# Altium schematic sheet Sheet1.SchDoc
size A4
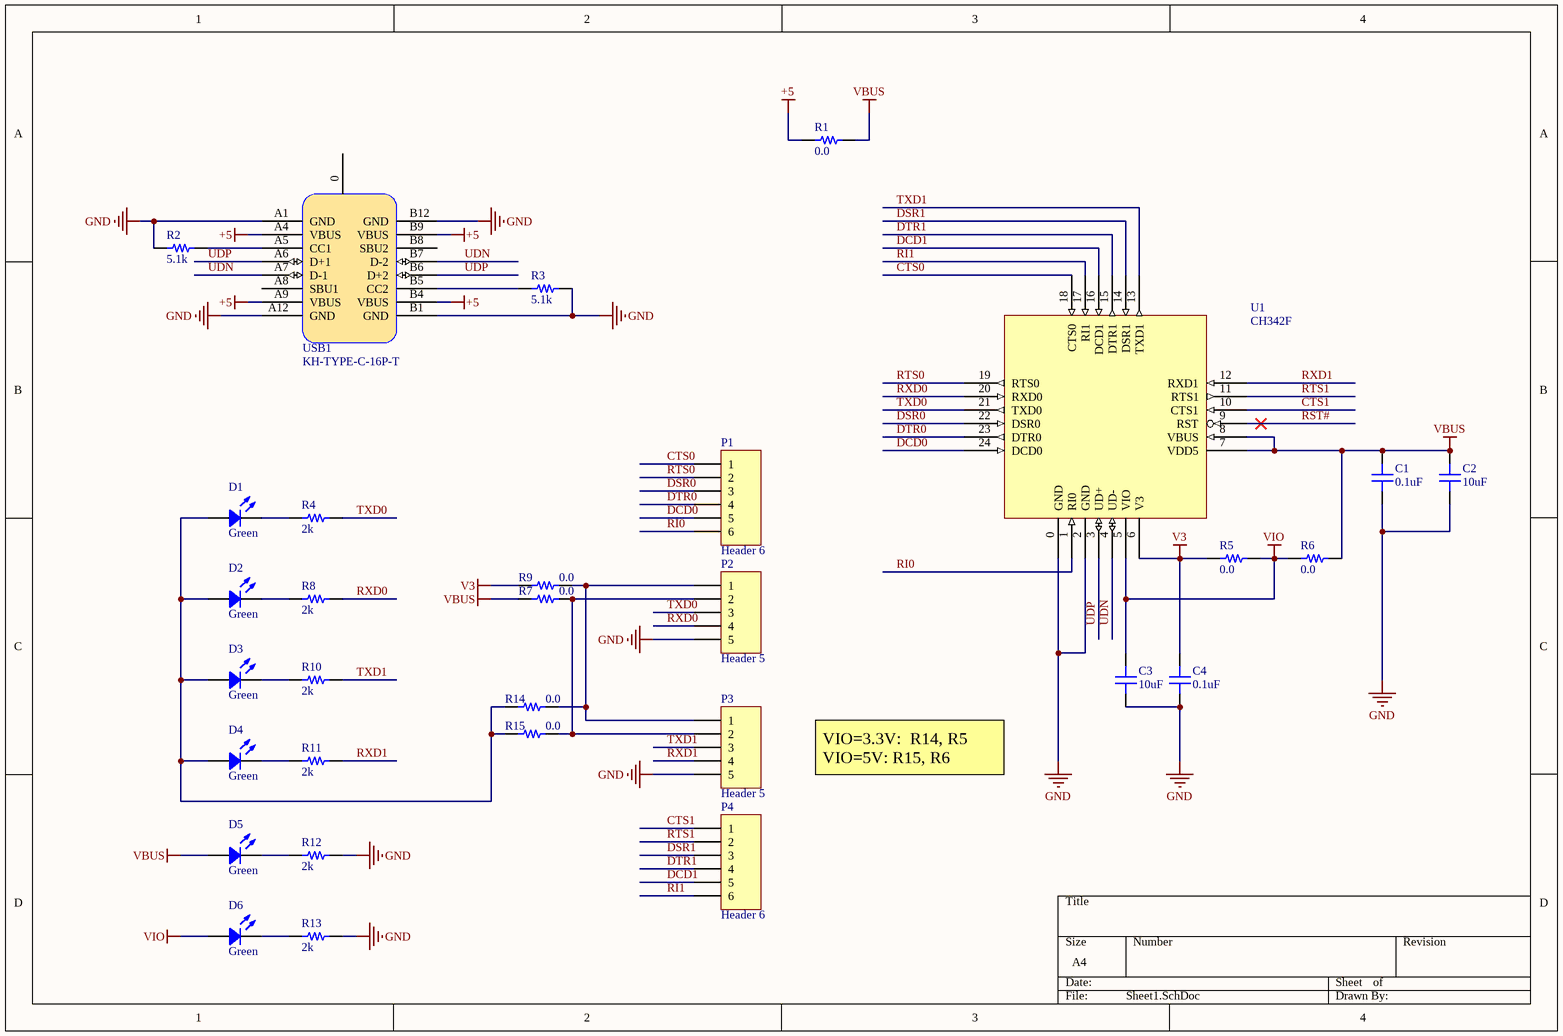
[diagram p0: Sheet1.SchDoc]

## Parts
C1  0.1uF  [CAP 0402/1005]
C2  10uF  [CAP 0805/2012]
C3  10uF  [CAP 0805/2012]
C4  0.1uF  [CAP 0402/1005]
D1  Green  [LED 0805/2012 GREEN]
D2  Green  [LED 0805/2012 GREEN]
D3  Green  [LED 0805/2012 GREEN]
D4  Green  [LED 0805/2012 GREEN]
D5  Green  [LED 0805/2012 GREEN]
D6  Green  [LED 0805/2012 GREEN]
P1  Header 6  [HDR1X6]
P2  Header 5  [HDR1X5]
P3  Header 5  [HDR1X5]
P4  Header 6  [HDR1X6]
R1  0.0  [RES 0805/2012]
R2  5.1k  [RES 0402/1005]
R3  5.1k  [RES 0402/1005]
R4  2k  [RES 0402/1005]
R5  0.0  [RES 0805/2012]
R6  0.0  [RES 0805/2012]
R7  0.0  [RES 0805/2012]
R8  2k  [RES 0402/1005]
R9  0.0  [RES 0805/2012]
R10  2k  [RES 0402/1005]
R11  2k  [RES 0402/1005]
R12  2k  [RES 0402/1005]
R13  2k  [RES 0402/1005]
R14  0.0  [RES 0402/1005]
R15  0.0  [RES 0402/1005]
U1  CH342F  [QFN24_4X4]
USB1  KH-TYPE-C-16P-T  [TYPE-C-M-16P]

## Nets
+5: R1.1 USB1.A4(VBUS) USB1.A9(VBUS) USB1.B4(VBUS) USB1.B9(VBUS)
GND: C1.1 C2.1 C3.1 C4.1 P2.5 P3.5 R2.1 R3.2 R12.1 R13.1 U1.0(GND) U1.2(GND) USB1.A1(GND) USB1.A12(GND) USB1.B1(GND) USB1.B12(GND)
V3: C4.2 R5.1 R9.1 U1.6(V3)
VBUS: C1.2 C2.2 D5.1 R1.2 R6.2 R7.1 U1.7(VDD5) U1.8(VBUS)
VIO: C3.2 D6.1 R5.2 R6.1 U1.5(VIO)
CTS0: P1.1 U1.18(CTS0)
CTS1: P4.1 U1.10(CTS1)
DCD0: P1.5 U1.24(DCD0)
DCD1: P4.5 U1.16(DCD1)
DSR0: P1.3 U1.22(DSR0)
DSR1: P4.3 U1.14(DSR1)
DTR0: P1.4 U1.23(DTR0)
DTR1: P4.4 U1.15(DTR1)
RI0: P1.6 U1.1(RI0)
RI1: P4.6 U1.17(RI1)
RST#: U1.9(RST)
RTS0: P1.2 U1.19(RTS0)
RTS1: P4.2 U1.11(RTS1)
RXD0: P2.4 R8.1 U1.20(RXD0)
RXD1: P3.4 R11.1 U1.12(RXD1)
TXD0: P2.3 R4.1 U1.21(TXD0)
TXD1: P3.3 R10.1 U1.13(TXD1)
UDN: U1.4(UD-) USB1.A7(D-1) USB1.B7(D-2)
UDP: U1.3(UD+) USB1.A6(D+1) USB1.B6(D+2)
NetD1_1: D1.1 D2.1 D3.1 D4.1 R14.1 R15.1
NetD1_2: D1.2 R4.2
NetD2_2: D2.2 R8.2
NetD3_2: D3.2 R10.2
NetD4_2: D4.2 R11.2
NetD5_2: D5.2 R12.2
NetD6_2: D6.2 R13.2
NetP2_1: P2.1 P3.1 R9.2 R14.2
NetP2_2: P2.2 P3.2 R7.2 R15.2
NetR2_2: R2.2 USB1.A5(CC1)
NetR3_1: R3.1 USB1.B5(CC2)

Not connected (* = marked no-connect by the designer): USB1 0 A8(SBU1) B8(SBU2)

## Notes on the sheet
- VIO=3.3V:  R14, R5
  VIO=5V: R15, R6

## Library data of the parts
C1 C4 = C1005X7R1C104K050BC: CAP CER 0.1UF 16V X7R 0402; Manufacturer: TDK Corporation; TemperatureRange: -55C ~ 125C; Tolerance: 10%; Value: 0.1uF; Part Number: C1005X7R1C104K050BC; PartId: 3856; Supplier 1: Digi-Key; Supplier Part Number 1: 445-4952-2-ND; ComponentLink1Description: Datasheet; ComponentLink1URL: https://product.tdk.com/info/en/catalog/datasheets/mlcc_commercial_general_en.pdf; ComponentLink2Description: Digi-Key listing; ComponentLink2URL: http://digikey.com/product-detail/en/C1005X7R1C104K050BC/445-4952-2-ND/2093220; TemperatureCoefficient: X7R; Voltage: 16V; Price: 0.0066; Type: -; Device Package: 0402 (1005 Metric)
C2 C3 = C2012X5R1A106K125AB: CAP CER 10UF 10V X5R 0805; Manufacturer: TDK Corporation; TemperatureRange: -55C ~ 85C; Tolerance: 10%; Value: 10uF; Part Number: C2012X5R1A106K125AB; PartId: 4519; Supplier 1: Digi-Key; Supplier Part Number 1: 445-7660-2-ND; ComponentLink1Description: Datasheet; ComponentLink1URL: https://product.tdk.com/info/en/catalog/datasheets/mlcc_commercial_general_en.pdf; ComponentLink2Description: Digi-Key listing; ComponentLink2URL: http://digikey.com/product-detail/en/C2012X5R1A106K125AB/445-7660-2-ND/2345074; TemperatureCoefficient: X5R; Voltage: 10V; Price: 0.0521; Type: -; Device Package: 0805 (2012 Metric)
D1-D6 = LTST-C171GKT: LED GREEN CLEAR 0805 SMD; Manufacturer: Lite-On Inc.; Type: Surface Mount; Millicandela: 12mcd; Voltage Forward: 2.1V; Current (Test): 20mA; Viewing Angle: 130; Value: Green; Part Number: LTST-C171GKT; PartId: 7075; Supplier 1: Digi-Key; Supplier Part Number 1: 160-1423-2-ND; ComponentLink1Description: Datasheet; ComponentLink1URL: http://media.digikey.com/pdf/Data%20Sheets/Lite-On%20PDFs/LTST-C171GKT.pdf; ComponentLink2Description: Digi-Key Listing; ComponentLink2URL: http://www.digikey.ca/product-detail/en/LTST-C171GKT/160-1423-2-ND/386793; Price: 0.0599; Device Package: 0805 (2012 Metric); Colour: Green; Lens Transparency: Clear
P1 P4 = Header 6: Header, 6-Pin; LatestRevisionDate: 17-Jul-2002; LatestRevisionNote: Re-released for DXP Platform.; Publisher: Altium Limited
P2 P3 = Header 5: Header, 5-Pin; LatestRevisionDate: 17-Jul-2002; LatestRevisionNote: Re-released for DXP Platform.; Publisher: Altium Limited
R1 R5-R7 R9 = MCR10EZPJ000: RES SMD 0.0 OHM JUMPER 1/8W 0805; Manufacturer: Rohm Semiconductor; TemperatureRange: -55C ~ 155C; PowerRating: 0.125W, 1/8W; Value: 0.0; Part Number: MCR10EZPJ000; PartId: 16153; Supplier 1: Digi-Key; Supplier Part Number 1: RHM0.0ARTR-ND; ComponentLink1Description: Datasheet; ComponentLink1URL: http://rohmfs.rohm.com/en/products/databook/datasheet/passive/resistor/chip_resistor/mcr.pdf; ComponentLink2Description: Digi-Key Listing; ComponentLink2URL: https://www.digikey.com/product-detail/en/rohm-semiconductor/MCR10EZPJ000/RHM0.0ARTR-ND/1213299; Tolerance: Jumper; Price: 0.0049; Device Package: 0805 (2012 Metric)
R2 R3 = ERJ-2RKF5101X: RES SMD 5.1K OHM 1% 1/10W 0402; Manufacturer: Panasonic Electronic Components; TemperatureRange: -55C ~ 155C; TemperatureCoefficient: 100ppm/C; PowerRating: 0.1W, 1/10W; Value: 5.1k; Part Number: ERJ-2RKF5101X; PartId: 274; Supplier 1: Digi-Key; Supplier Part Number 1: P5.10KLTR-ND; ComponentLink1Description: Datasheet; ComponentLink1URL: http://industrial.panasonic.com/www-cgi/jvcr13pz.cgi?E+PZ+3+AOA0002+ERJ2RKF5101X+7+WW; ComponentLink2Description: Digikey listing; ComponentLink2URL: http://digikey.com/product-detail/en/ERJ-2RKF5101X/P5.10KLTR-ND/1746242; Tolerance: 1%; Price: 0.0043; Type: Thick Film; Device Package: 0402 (1005 Metric)
R4 R8 R10-R13 = RC0402JR-072KL: RES SMD 2K OHM 5% 1/16W 0402; Manufacturer: Yageo; TemperatureRange: -55C ~ 155C; TemperatureCoefficient: 100ppm/C; PowerRating: 0.063W, 1/16W; Value: 2k; Part Number: RC0402JR-072KL; PartId: 14511; Supplier 1: Digi-Key; Supplier Part Number 1: 311-2.0KJRTR-ND; ComponentLink1Description: Datasheet; ComponentLink1URL: http://www.yageo.com/documents/recent/PYu-RC_Group_51_RoHS_L_04.pdf; ComponentLink2Description: Digi-Key Listing; ComponentLink2URL: https://www.digikey.com/product-detail/en/yageo/RC0402JR-072KL/311-2.0KJRTR-ND/726434; Tolerance: 5%; Price: 0.0017; Device Package: 0402 (1005 Metric)
R14 R15 = ERJ-2GE0R00X: RES SMD 0.0OHM JUMPER 1/10W 0402; Manufacturer: Panasonic Electronic Components; TemperatureRange: -55C ~ 155C; PowerRating: 0.1W, 1/10W; Value: 0.0; Part Number: ERJ-2GE0R00X; PartId: 16129; Supplier 1: Digi-Key; Supplier Part Number 1: P0.0JTR-ND; ComponentLink1Description: Datasheet; ComponentLink1URL: http://industrial.panasonic.com/www-cgi/jvcr13pz.cgi?E+PZ+3+AOA0001+ERJ2GE0R00X+7+WW; ComponentLink2Description: Digi-Key Listing; ComponentLink2URL: https://www.digikey.com/product-detail/en/panasonic-electronic-components/ERJ-2GE0R00X/P0.0JTR-ND/146727; Tolerance: Jumper; Price: 0.0029; Device Package: 0402 (1005 Metric)
U1 = CH342F: USB to dual enhanced TTL Serial / 2*UART
USB1 = KH-TYPE-C-16P-T: Type-C母座 16PIN 立式四角贴板双压片